# Altium schematic sheet main.SchDoc: Generador de Funciones
size A4; Author: Zuliani, Agustin; Revision: v1.0; SheetNumber: 1; SheetTotal: 6
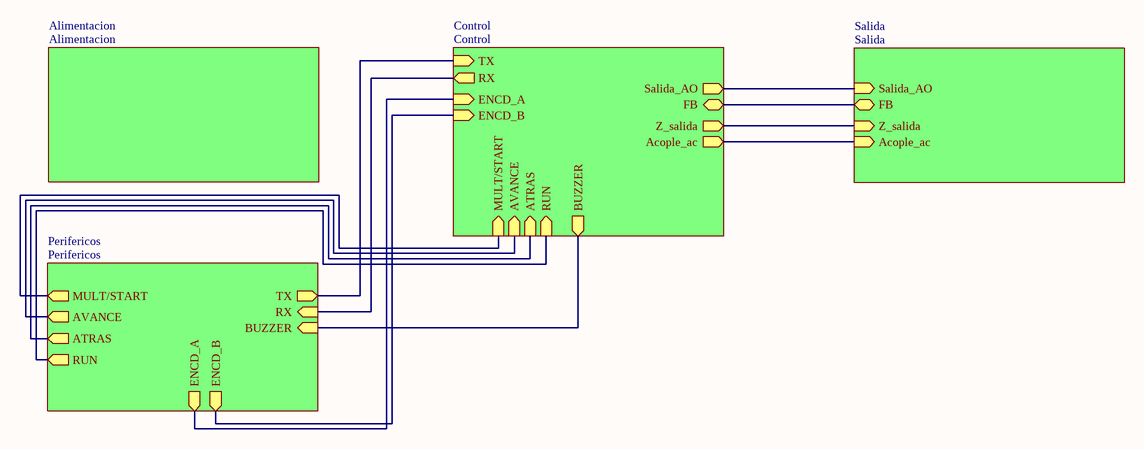
[diagram p0: main.SchDoc]

## Sub-sheets
Alimentacion = Alimentacion: no entries
Control = Control: TX (in), AVANCE (in), BUZZER (out), RUN (in), ENCD_B (in), MULT/START (in), Salida_AO (out), ATRAS (in), RX (out), Z_salida (out), Acople_ac (out), ENCD_A (in), FB (bidir)
Perifericos = Perifericos: BUZZER (in), ENCD_A (out), MULT/START (out), AVANCE (out), ATRAS (out), RUN (out), TX (out), RX (in), ENCD_B (out)
Salida = Salida: Salida_AO (in), Acople_ac (in), FB (bidir), Z_salida (in)

## Nets
(unnamed): sheet Control/TX, sheet Perifericos/TX
(unnamed): sheet Control/AVANCE, sheet Perifericos/AVANCE
(unnamed): sheet Control/BUZZER, sheet Perifericos/BUZZER
(unnamed): sheet Control/RUN, sheet Perifericos/RUN
(unnamed): sheet Control/ENCD_B, sheet Perifericos/ENCD_B
(unnamed): sheet Control/MULT/START, sheet Perifericos/MULT/START
(unnamed): sheet Control/Salida_AO, sheet Salida/Salida_AO
(unnamed): sheet Control/ATRAS, sheet Perifericos/ATRAS
(unnamed): sheet Control/RX, sheet Perifericos/RX
(unnamed): sheet Control/Z_salida, sheet Salida/Z_salida
(unnamed): sheet Control/Acople_ac, sheet Salida/Acople_ac
(unnamed): sheet Control/ENCD_A, sheet Perifericos/ENCD_A
(unnamed): sheet Control/FB, sheet Salida/FB